# EAGLE design untitled (EAGLE 9.6.2)
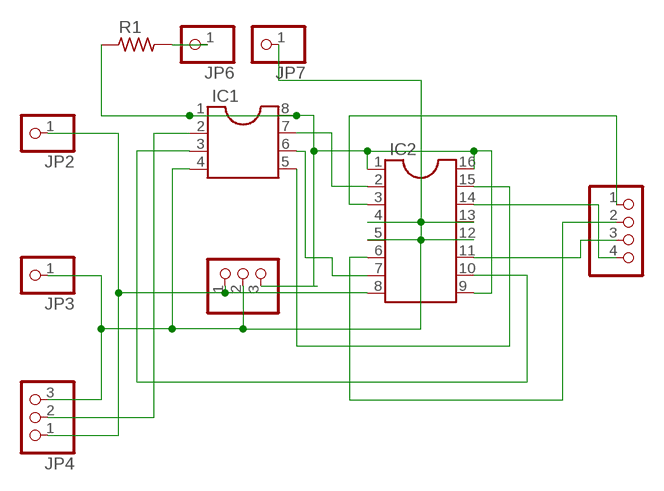
[diagram p0: schematic, sheet 1]

## Parts
IC1  DIL8S  [SOCKET-08]
IC2  DIL16S  [SOCKET-16]
JP1  PINHD-1X4  [1X04]
JP2  PINHD-1X1  [1X01]
JP3  PINHD-1X1  [1X01]
JP4  PINHD-1X3  [1X03]
JP5  PINHD-1X3  [1X03]
JP6  PINHD-1X1  [1X01]
JP7  PINHD-1X1  [1X01]
R1  RC-MASTER-SMD_R_0603MP  [RC-MASTER-SMD_R0603MP]

## Nets
GND: IC1.4 IC2.4 IC2.5 IC2.12 IC2.13 JP3.1 JP4.3 JP5.2 JP7.1
N$1: IC2.3 JP1.1
N$2: IC2.6 JP1.2
N$3: IC1.2 JP4.2
N$4: IC1.7 IC2.2
N$5: IC1.6 IC2.7
N$6: IC1.5 IC2.15
N$7: IC1.3 IC2.10
N$8: IC2.11 JP1.3
N$9: IC2.14 JP1.4
N$10: JP6.1 R1.2
V: IC1.1 IC1.8 IC2.1 IC2.9 IC2.16 JP5.3 R1.1
VDD: IC2.8 JP2.1 JP4.1 JP5.1

## Library data of the parts
IC1 = ic-package:DIL8: Dual In Line / Socket
IC2 = ic-package:DIL16: Dual In Line / Socket
JP1 = DC_LOAD_AU:PINHD-1X4: PIN HEADER
JP2 JP3 JP6 JP7 = adafruit:PINHD-1X1: Pin header 1x1 for 0.1" spacing With round pins
JP4 JP5 = adafruit:PINHD-1X3: PIN HEADER
R1 = LinkedLibrary52101:RC-MASTER-SMD_R_: RESISTOR

## Board
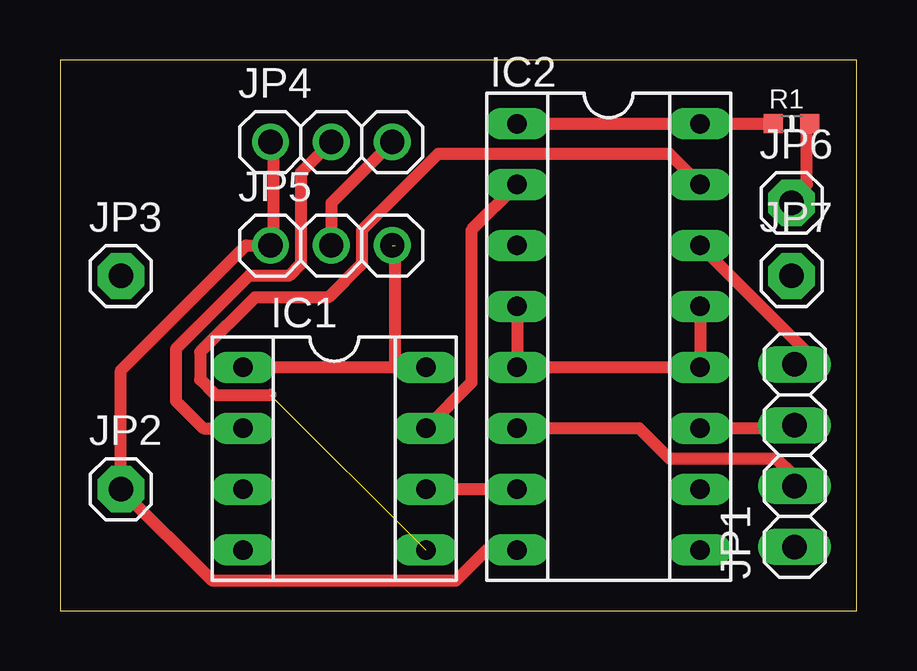
[diagram p1: board, top side]
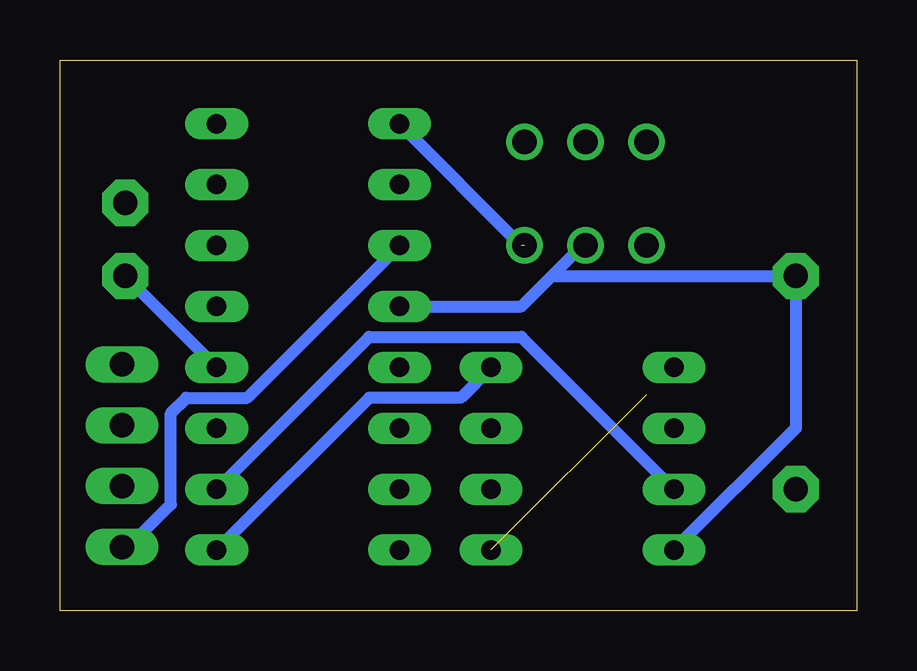
[diagram p2: board, bottom side, seen from below]

Size 33.2 x 22.98 mm. Coordinates in mm from the lower left corner, seen from the top.
Outline: 0,0 33.2,0 33.2,22.98 0,22.98 0,0
Copper layers (1*16): Top 0.035mm / dielectric 1.5mm / Bottom 0.035mm
Design rules "default": minimum track width 6mil, minimum drill 0.35mm, track to track 6mil, track to pad 6mil, pad to pad 6mil, via to via 6mil, smd to smd 6mil, copper to edge 40mil, drill to drill 6mil, minimum pad ring 10mil, minimum via ring 8mil, stop-mask expansion 4mil, vias tented up to drill 0mil, thermal gap 10mil

### Footprints (pad centres in the part's own frame; a part is rotated, then mirrored left to right if it is on the bottom)
SOCKET-08 = drill 0.813 long: 1 -3.81,-3.81; 2 -1.27,-3.81; 3 1.27,-3.81; 4 3.81,-3.81; 5 3.81,3.81; 6 1.27,3.81; 7 -1.27,3.81; 8 -3.81,3.81
SOCKET-16 = drill 0.813 long: 1 -8.89,-3.81; 2 -6.35,-3.81; 3 -3.81,-3.81; 4 -1.27,-3.81; 5 1.27,-3.81; 6 3.81,-3.81; 7 6.35,-3.81; 8 8.89,-3.81; 9 8.89,3.81; 10 6.35,3.81; 11 3.81,3.81; 12 1.27,3.81; 13 -1.27,3.81; 14 -3.81,3.81; 15 -6.35,3.81; 16 -8.89,3.81
1X04 = drill 1.016 long: 1 -3.81,0; 2 -1.27,0; 3 1.27,0; 4 3.81,0
1X01 = drill 1.016 pad 1.93 octagon: 1 0,0
1X03 = drill 1.016: 1 -2.54,0; 2 0,0; 3 2.54,0
RC-MASTER-SMD_R0603MP = smd 0.8 x 0.8: 1 -0.762,0; 2 0.762,0

### Placement (x,y rotation side)
IC1  11.43,6.35 270 top
IC2  22.86,11.43 270 top
JP1  30.61,6.48 90 top
JP2  2.54,5.08 0 top
JP3  2.54,13.97 0 top
JP4  11.3,19.56 0 top
JP5  11.3,15.24 0 top
JP6  30.48,17.02 0 top
JP7  30.48,13.97 0 top
R1  30.48,20.32 0 top

### Tracks (layer width: path | path; a pad name or v marks a point on that pad's centre or on a via)
GND
  Top 0.508: JP5.2 11.3,17.02 JP4.3 | IC2.4 IC2.5 IC2.12 IC2.13
  Bottom 0.508: IC1.4 2.54,7.62 JP3.1 12.7,13.97 | IC2.12 JP7.1 | 12.7,13.97 13.97,12.7 IC2.4 | 12.7,13.97 11.43,15.24 JP5.2
N$1
  Bottom 0.508: IC2.3 25.4,8.89 27.94,8.89 28.57,8.25 28.57,4.45 30.48,2.54 JP1.1
N$2
  Top 0.508: IC2.6 24.13,7.62 25.4,6.35 29.84,6.35 30.48,5.71 JP1.2
N$3
  Top 0.508: IC1.2 5.97,7.62 4.83,8.76 4.83,10.92 7.87,13.97 9.53,13.97 10.03,14.48 10.03,18.29 JP4.2
N$4
  Top 0.508: IC1.7 17.14,9.52 17.14,15.88 IC2.2
N$5
  Top 0.508: IC2.7 IC1.6
N$6  (1 unrouted)
  Top 0.508: 8.76,9.02 6.48,9.02 5.84,9.65 5.84,10.79 8.13,13.08 11.18,13.08 12.57,14.48 12.57,15.88 15.75,19.05 25.4,19.05 IC2.15
N$7
  Bottom 0.508: IC1.3 13.97,11.43 20.32,11.43 IC2.10
N$8
  Top 0.508: IC2.11 30.48,7.62 JP1.3
N$9
  Top 0.508: IC2.14 31.11,10.79 JP1.4
N$10
  Top 0.152: 30.48,17.15 31.11,17.78
  Top 0.508: 31.11,17.78 31.11,20.32 R1.2 | 30.48,17.15 JP6.1
V  (2 unrouted)
  Top 0.508: 29.84,20.32 R1.1 IC2.16 IC2.1 | 13.97,10.16 IC1.1 | 13.97,10.16 13.97,15.24 | 13.97,10.16 IC1.8
  Bottom 0.508: 13.97,15.24 IC2.1 | IC2.9 20.32,8.89 16.51,8.89 IC1.8
VDD
  Top 0.508: JP4.1 8.89,19.05 8.89,15.24 JP5.1 7.75,15.24 2.54,10.03 JP2.1 6.35,1.27 16.51,1.27 17.78,2.54 IC2.8